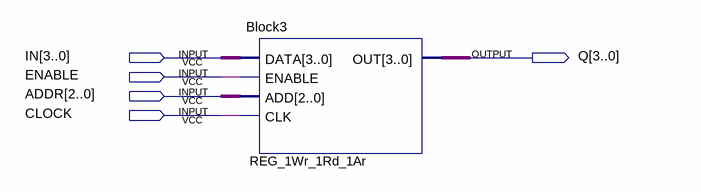
[diagram p0: schematic sheet]
// Quartus schematic Block1.bdf as structural Verilog: 1 symbols, 5 pins
module Block1 (
  input  [3:0] IN,
  input  ENABLE,
  input  [2:0] ADDR,
  input  CLOCK,
  output [3:0] Q
);

  Block3 REG_1Wr_1Rd_1Ar (.DATA(IN), .ENABLE(ENABLE), .ADD(ADDR), .CLK(CLOCK), .OUT(Q));
endmodule
